# EAGLE design wall_power (EAGLE 6.4)
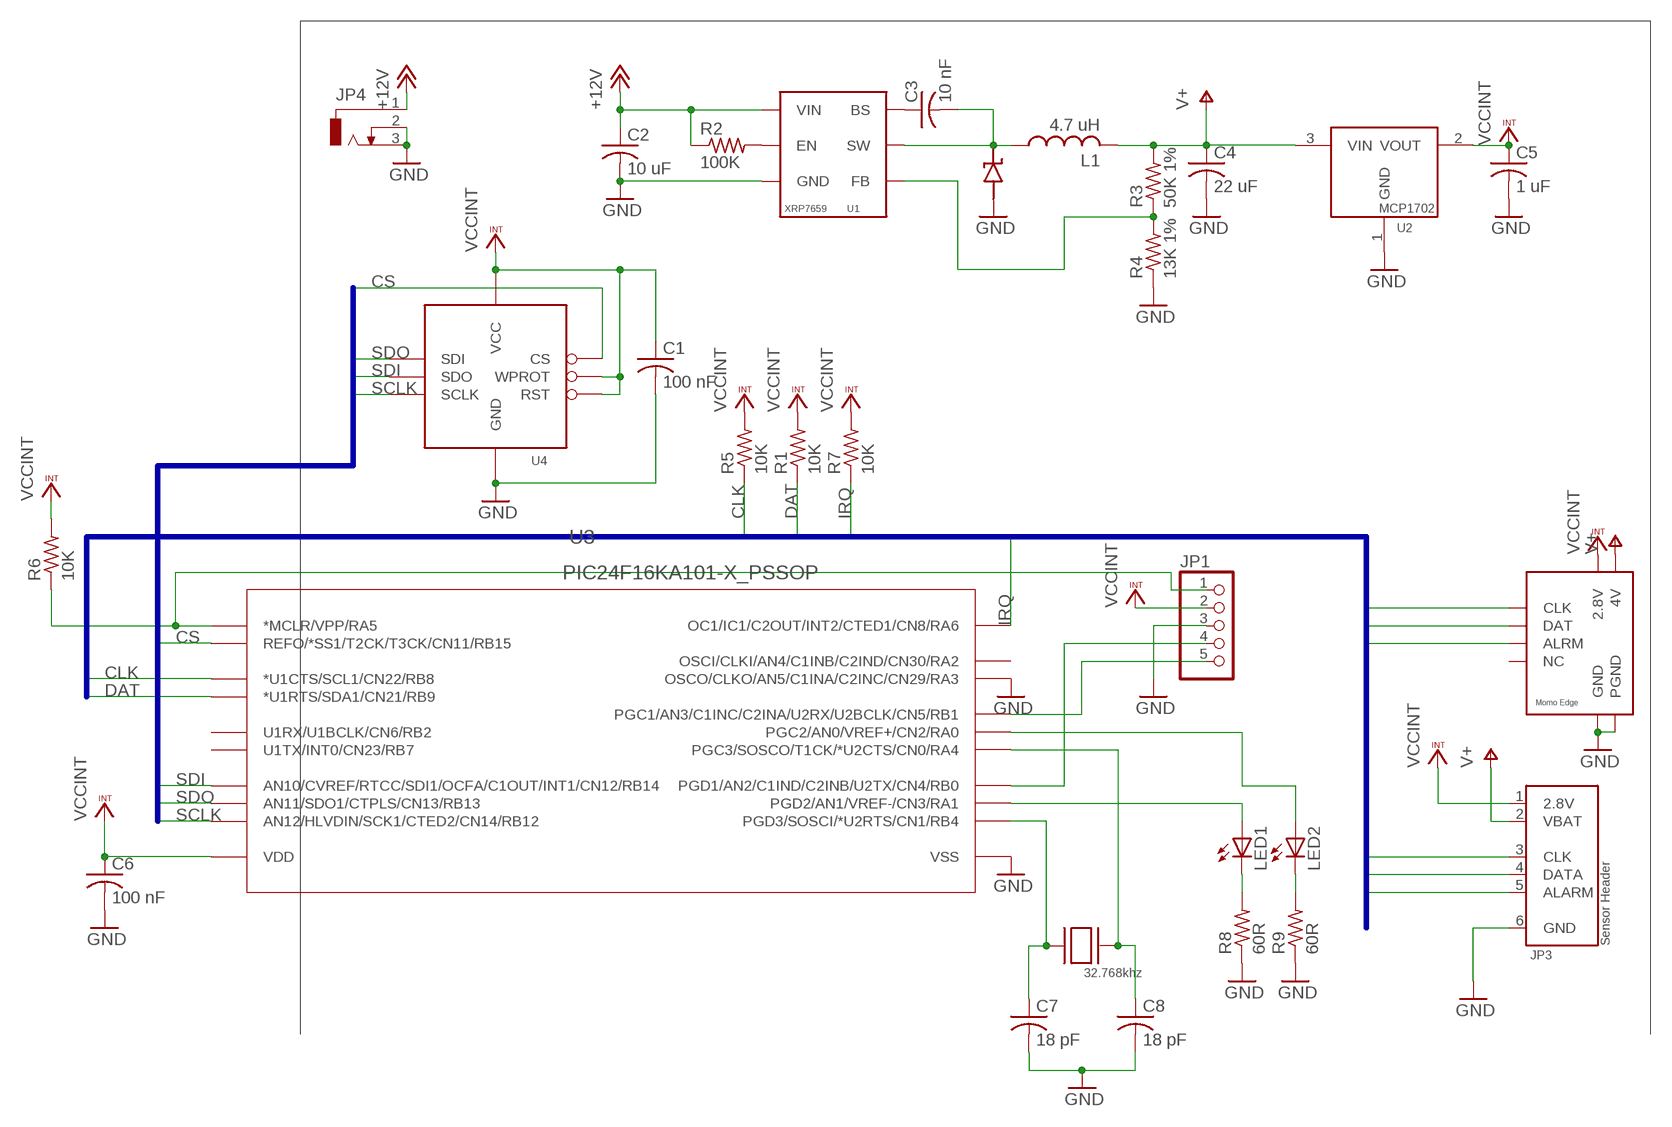
[diagram p0: schematic, sheet 1]

## Parts
C1  100 nF  C-USC0402  [C0402]
C2  10 uF  C-USC0805  [C0805]
C3  10 nF  C-USC0402  [C0402]
C4  22 uF  C-USC1206  [C1206]
C5  1 uF  C-USC0402  [C0402]
C6  100 nF  C-USC0402  [C0402]
C7  18 pF  C-USC0402K  [C0402K]
C8  18 pF  C-USC0402K  [C0402K]
D1  DIODE_SS2P3SS2P3  [DIODE_SS2P3]
JP1  PINHD-1X5  [1X05]
JP2  MOMO-EDGE-8F  [MOMO-EDGE-8F]
JP3  MOMO-SENSOR-HEADER  [2X3-MOLEX-90130]
JP4  DCJ0303  [DCJ0303]
L1  4.7 uH  NR6028-INDUCTOR  [NR6028-INDUCTOR]
LED1  LEDSML0603  [SML0603]
LED2  LEDSML0603  [SML0603]
R1  10K  R-US_R0603  [R0603]
R2  100K  R-US_R0603  [R0603]
R3  50K 1%  R-US_R0603  [R0603]
R4  13K 1%  R-US_R0603  [R0603]
R5  10K  R-US_R0603  [R0603]
R6  10K  R-US_R0603  [R0603]
R7  10K  R-US_R0603  [R0603]
R8  60R  R-US_R0603  [R0603]
R9  60R  R-US_R0603  [R0603]
U1  XRP7659  [SOT23-6L]
U2  MCP1702  [SOT23]
U3  PIC24F16KA101-X_PSSOP  [SSOP20]
U4  FLASH8MSOP8  [SOP08]
XTAL1  32.768khz  SMD-XTAL  [1206]

## Nets
+12V: C2.1 JP4.1 R2.1 U1.5(VIN)
CLK: JP2.CLK JP3.3(CLK) R5.1 U3.12(*U1CTS/SCL1/CN22/RB8)
CS: U3.18(REFO/*SS1/T2CK/T3CK/CN11/RB15) U4.1(CS)
DAT: JP2.DAT JP3.4(DATA) R1.1 U3.13(*U1RTS/SDA1/CN21/RB9)
GND: C1.2 C2.2 C4.2 C5.2 C6.2 C7.2 C8.2 D1.AN JP1.3 JP2.GND JP2.PGND JP3.6(GND) JP4.2 JP4.3 R4.1 R8.1 R9.1 U1.2(GND) U2.1(GND) U3.8(OSCO/CLKO/AN5/C1INA/C2INC/CN29/RA3) U3.19(VSS) U4.4(GND)
IRQ: JP2.ARLM(ALRM) JP3.5(ALARM) R7.1 U3.14(OC1/IC1/C2OUT/INT2/CTED1/CN8/RA6)
N$1: LED2.A U3.2(PGC2/AN0/VREF+/CN2/RA0)
N$2: C3.2 D1.CATH L1.1 U1.6(SW)
N$3: R2.2 U1.4(EN)
N$4: C3.1 U1.1(BS)
N$5: LED2.C R9.2
N$6: R3.1 R4.2 U1.3(FB)
N$7: LED1.C R8.2
N$8: LED1.A U3.3(PGD2/AN1/VREF-/CN3/RA1)
N$9: JP1.4 U3.4(PGD1/AN2/C1IND/C2INB/U2TX/CN4/RB0)
N$10: JP1.5 U3.5(PGC1/AN3/C1INC/C2INA/U2RX/U2BCLK/CN5/RB1)
N$15: JP1.1 R6.1 U3.1(*MCLR/VPP/RA5)
N$24: C8.1 U3.10(PGC3/SOSCO/T1CK/*U2CTS/CN0/RA4) XTAL1.P$2(XTAL2)
N$25: C7.1 U3.9(PGD3/SOSCI/*U2RTS/CN1/RB4) XTAL1.P$1(XTAL1)
SCLK: U3.15(AN12/HLVDIN/SCK1/CTED2/CN14/RB12) U4.6(SCLK)
SDI: U3.17(AN10/CVREF/RTCC/SDI1/OCFA/C1OUT/INT1/CN12/RB14) U4.2(SDO)
SDO: U3.16(AN11/SDO1/CTPLS/CN13/RB13) U4.5(SDI)
V+: C4.1 JP2.V4.(4V) JP3.2(VBAT) L1.2 R3.2 U2.3(VIN)
VCCINT: C1.1 C5.1 C6.1 JP1.2 JP2.V28(2.8V) JP3.1(2.8V) R1.2 R5.2 R6.2 R7.2 U2.2(VOUT) U3.20(VDD) U4.3(WPROT) U4.7(RST) U4.8(VCC)
Unconnected: JP2.NV(NC) U3.6(U1RX/U1BCLK/CN6/RB2) U3.7(OSCI/CLKI/AN4/C1INB/C2IND/CN30/RA2) U3.11(U1TX/INT0/CN23/RB7)

## Buses
PICBUS:CLK,DAT,IRQ
SPI:CS,SDI,SDO,SCLK

## Library data of the parts
C1-C8 = rcl:C-US: CAPACITOR, American symbol
D1 = components:DIODE_SS2P3
JP1 = pinhead:PINHD-1X5: PIN HEADER
JP2 = components:MOMO-EDGE-8F
JP3 = components:MOMO-SENSOR-HEADER
JP4 = con-jack:DCJ0303: DC POWER JACK Source: DCJ0303.pdf; OC_FARNELL: unknown; OC_NEWARK: unknown
L1 = components:NR6028-INDUCTOR
LED1 LED2 = led:LED: LED OSRAM: - CHIPLED LG R971, LG N971, LY N971, LG Q971, LY Q971, LO R971, LY R971 LH N974, LH R974 LS Q976, LO Q976, LY Q976 LO Q996 - Hyper CHIPLED LW Q18S LB Q993, LB Q99A, LB R99A - SideLED LS A670, LO A670, LY A670, LG A670, LP A670 LB A673, LV A673, LT A673, LW A673 LH A674 LY A675 LS A676, LA A676, LO A676, LY A676, LW A676 LS A679, LY A679, LG A679 - Hyper Micro SIDELED® LS Y876, LA Y876, LO Y876, LY Y876 LT Y87S - SmartLED LW L88C, LW L88S LB L89C, LB L89S, LG L890 LS L89K, LO L89K, LY L89K LS L896, LA L896, LO L896, LY L896 - TOPLED LS T670, LO T670, LY T670, LG T670, LP T670 LSG T670, LSP T670, LSY T670, LOP T670, LYG T670 LG T671, LOG T671, LSG T671 LB T673, LV T673, LT T673, LW T673 LH T674 LS T676, LA T676, LO T676, LY T676, LB T676, LH T676, LSB T676, LW T676 LB T67C, LV T67C, LT T67C, LS T67K, LO T67K, LY T67K, LW E67C LS E67B, LA E67B, LO E67B, LY E67B, LB E67C, LV E67C, LT E67C LW T67C LS T679, LY T679, LG T679 LS T770, LO T770, LY T770, LG T770, LP T770 LB T773, LV T773, LT T773, LW T773 LH T774 LS E675, LA E675, LY E675, LS T675 LS T776, LA T776, LO T776, LY T776, LB T776 LHGB T686 LT T68C, LB T68C - Hyper Mini TOPLED® LB M676 - Mini TOPLED Santana® LG M470 LS M47K, LO M47K, LY M47K Source: http://www.osram.convergy.de LUXEON: - LUMILED® LXK2-PW12-R00, LXK2-PW12-S00, LXK2-PW14-U00, LXK2-PW14-V00 LXK2-PM12-R00, LXK2-PM12-S00, LXK2-PM14-U00 LXK2-PE12-Q00, LXK2-PE12-R00, LXK2-PE12-S00, LXK2-PE14-T00, LXK2-PE14-U00 LXK2-PB12-K00, LXK2-PB12-L00, LXK2-PB12-M00, LXK2-PB14-N00, LXK2-PB14-P00, LXK2-PB14-Q00 LXK2-PR12-L00, LXK2-PR12-M00, LXK2-PR14-Q00, LXK2-PR14-R00 LXK2-PD12-Q00, LXK2-PD12-R00, LXK2-PD12-S00 LXK2-PH12-R00, LXK2-PH12-S00 LXK2-PL12-P00, LXK2-PL12-Q00, LXK2-PL12-R00 Source: www.luxeon.com KINGBRIGHT: KA-3528ASYC Source: www.kingbright.com
R1-R9 = rcl:R-US_: RESISTOR, American symbol
U1 = components:XRP7659
U2 = components:MCP1702
U3 = components:PIC24F16KA101-X_P
U4 = components:FLASH8M
XTAL1 = components:SMD-XTAL

## Net classes
0 default: width 0.152 mm, drill 0.305 mm, clearance 0.152 mm

## Board
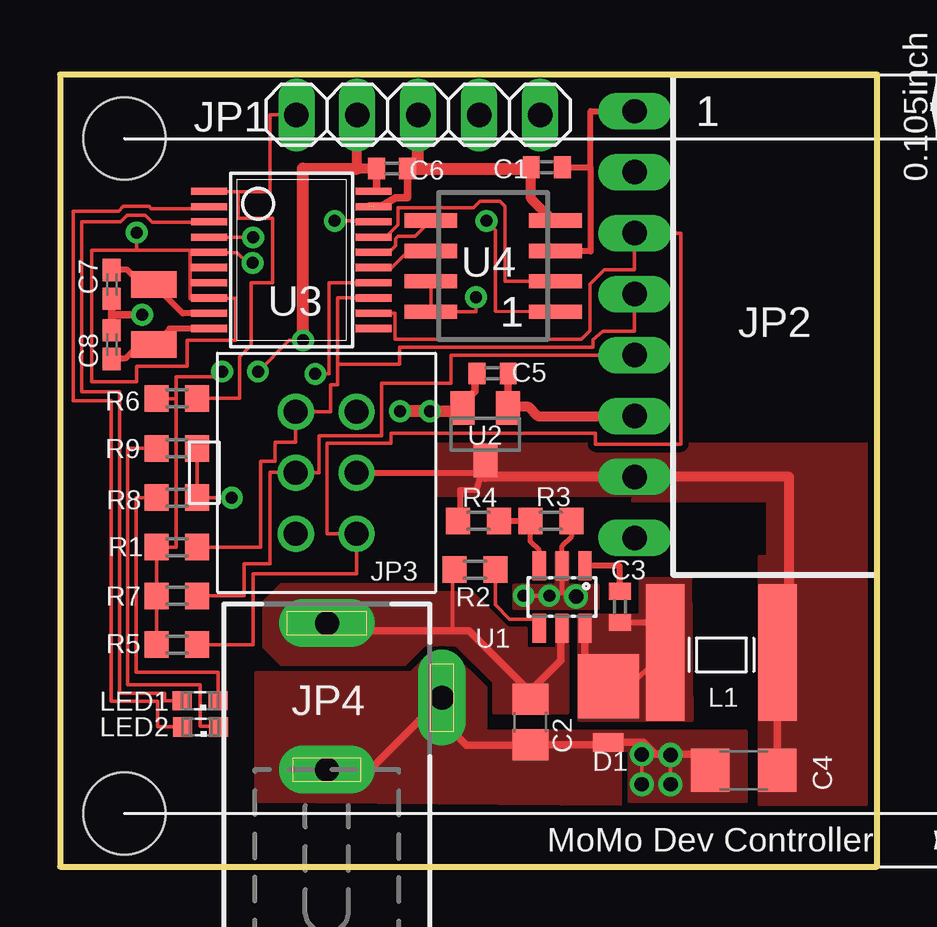
[diagram p1: board, top side]
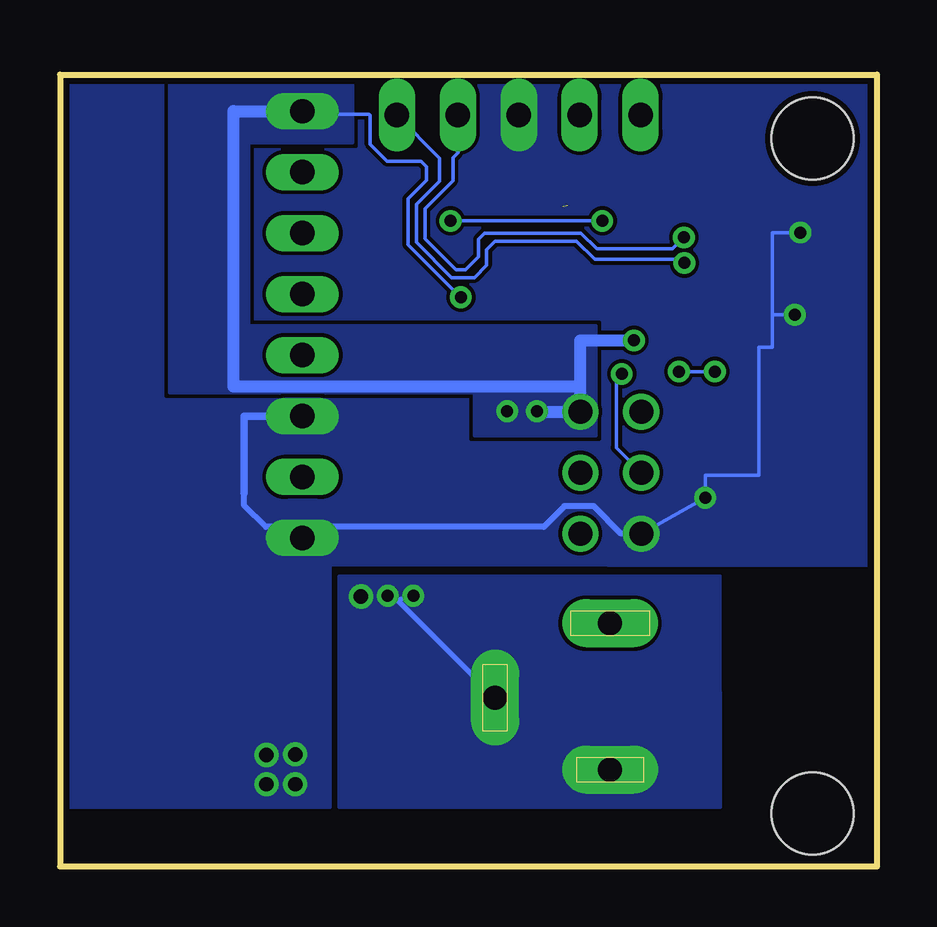
[diagram p2: board, bottom side, seen from below]

Size 34.06 x 32.99 mm. Coordinates in mm from the lower left corner, seen from the top.
Outline: 0,0 34.06,0 34.06,32.99 0,32.99 0,0
Copper layers (1*16): Top 0.035mm / dielectric 1.5mm / Bottom 0.035mm
Design rules "default *": minimum track width 6mil, minimum drill 19mil, track to track 6mil, track to pad 6mil, pad to pad 6mil, via to via 6mil, smd to smd 6mil, copper to edge 10mil, drill to drill 8mil, minimum pad ring 10mil, minimum via ring 8mil, stop-mask expansion 4mil, vias tented up to drill 0mil, thermal gap 10mil
Holes 3.43 mm at 2.69,2.21 2.69,30.33

### Footprints (pad centres in the part's own frame; a part is rotated, then mirrored left to right if it is on the bottom)
C0402 = smd 0.7 x 0.9: 1 -0.65,0; 2 0.65,0
C0805 = smd 1.3 x 1.5: 1 -0.95,0; 2 0.95,0
C1206 = smd 1.6 x 1.8: 1 -1.4,0; 2 1.4,0
C0402K = smd 0.925 x 0.74: 1 -0.6,0; 2 0.6,0
DIODE_SS2P3 = smd 0.762 x 1.27: AN 2.349,0 | smd 2.667 x 2.54: CATH 0,0
1X05 = drill 1.016 long: 1 -5.08,0; 2 -2.54,0; 3 0,0; 4 2.54,0; 5 5.08,0
MOMO-EDGE-8F = drill 1.016 long: ARLM 0,0; CLK 0,5.08; DAT 0,2.54; GND 0,-2.54; NV 0,7.62; PGND 0,-7.62; V4. 0,-5.08; V28 0,10.16
2X3-MOLEX-90130 = drill 1: 1 -2.54,2.54; 2 0,2.54; 3 2.54,2.54; 4 -2.54,0; 5 0,0; 6 2.54,0
DCJ0303 = drill 1 pad 2 long: 1 0,3.1; 2 4.8,0; 3 0,-3
NR6028-INDUCTOR = smd 1.6 x 5.7: 1 0,0; 2 4.7,0
SML0603 = smd 0.8 x 0.8: A 0.75,0; C -0.75,0
R0603 = smd 1 x 1.1: 1 -0.85,0; 2 0.85,0
SOT23-6L = smd 0.55 x 1.2: 1 -0.95,-1.3; 2 0,-1.3; 3 0.95,-1.3; 4 0.95,1.3; 5 0,1.3; 6 -0.95,1.3
SOT23 = smd 1 x 1.4: 1 -0.95,-1.1; 2 0.95,-1.1; 3 0,1.1
SSOP20 = smd 0.3 x 1.5: 1 -2.857,-3.431; 2 -2.222,-3.431; 3 -1.587,-3.431; 4 -0.952,-3.431; 5 -0.317,-3.431; 6 0.318,-3.431; 7 0.953,-3.431; 8 1.588,-3.431; 9 2.223,-3.431; 10 2.858,-3.431; 11 2.858,3.431; 12 2.219,3.431; 13 1.588,3.431; 14 0.953,3.431; 15 0.318,3.431; 16 -0.317,3.431; 17 -0.952,3.431; 18 -1.587,3.431; 19 -2.222,3.431; 20 -2.857,3.431
SOP08 = smd 0.6 x 2.2: 1 -1.905,-2.6; 2 -0.635,-2.6; 3 0.635,-2.6; 4 1.905,-2.6; 5 1.905,2.6; 6 0.635,2.6; 7 -0.635,2.6; 8 -1.905,2.6
1206 = smd 1.1 x 1.9: P$1 0,0; P$2 2.5,0

### Placement (x,y rotation side)
C1  20.29,29.13 180 top
C2  19.61,6.02 270 top
C3  23.34,10.82 270 top
C4  28.5,4.01 180 top
C5  18.03,20.55 0 top
C6  13.84,29.08 0 top
C7  2.16,24.26 270 top
C8  2.16,21.74 90 top
D1  22.86,7.52 270 top
JP1  14.94,31.32 0 top
JP2  23.95,21.31 0 top
JP3  9.83,16.41 270 top
JP4  11.13,7.04 0 top
L1  25.22,8.92 0 top
LED1  5.84,6.91 180 top
LED2  5.87,5.82 180 top
R1  4.88,13.31 180 top
R2  17.3,12.37 0 top
R3  17.45,14.4 180 top
R4  20.47,14.4 180 top
R5  4.88,9.25 180 top
R6  4.88,19.51 180 top
R7  4.88,11.28 180 top
R8  4.88,15.37 180 top
R9  4.88,17.42 180 top
U1  20.93,11.23 180 top
U2  17.73,18.01 180 top
U3  9.65,25.27 270 top
U4  18.06,25.02 90 top
XTAL1  3.91,24.26 270 top

### Tracks (layer width: path | path; a pad name or v marks a point on that pad's centre or on a via)
+12V
  Top 0.152: R2.1 16.36,12.37 16.36,9.83
  Top 0.305: C2.1 19.61,7.26 | 19.61,7.26 17.04,9.83 16.36,9.83 11.43,9.83 JP4.1 | 19.61,7.26 19.61,7.31 20.88,8.58 20.88,9.88 U1.5
  pour Top (no thermals): 21.16,10.44 21.16,6.4 18.08,6.4 18.08,7.67 16.51,9.25 15.19,9.25 14.38,8.43 9.22,8.43 8.51,9.14 8.51,11.02 9.22,11.73 15.62,11.73 15.62,11.4 17.2,11.4 18.67,9.93 19.43,9.93 19.43,9.07 20.73,9.07 20.73,10.44
CLK
  Top 0.152: R5.1 8.05,9.25 8.05,12.19 12.37,12.19 JP3.3 11.13,13.87 11.13,17.63 13.79,17.63 13.79,18.06 22.33,18.06 22.33,17.6 25.88,17.6 25.88,26.39 JP2.CLK 23.95,24.87 22.71,24.87 22.1,24.26 22.1,22.33 21.74,21.97 13.97,21.97 13.97,23.05 U3.12
CS  (via drill 0.5)
  Top 0.152: U4.1 18.16,23.14 18.16,26.52 v17.78,26.9 | v11.46,26.9 12.95,26.9 U3.18
  Bottom 0.152: v17.78,26.9 v11.46,26.9
DAT
  Top 0.152: 12.95,23.67 U3.13 12.95,23.7 11.58,23.7 11.58,20.93 | R1.1 8.36,13.31 8.36,16.89 8.97,16.89 8.97,17.68 9.83,17.68 JP3.4 11.28,18.95 11.28,20.07 11.58,20.07 11.58,20.93 | 11.58,20.93 14.15,20.93 14.15,21.64 22.23,21.64 22.23,21.95 22.63,22.3 23.95,22.3 JP2.DAT
GND  (via drill 0.5, 0.6)  (1 unrouted)
  Top 0.152: v25.45,3.43 v25.45,4.65 25.1,4.44 24.87,4.67 | v24.26,3.43 v24.26,4.67 24.23,4.47 24.63,4.86 | U3.8 7.32,23.68 7.32,21.92 5.31,21.92 5.31,20.85 3.2,20.85 3.2,20.19 1.32,20.19 1.32,25.68 3.2,25.68 | 3.2,25.68 5.44,25.68 5.44,23.65 6.4,23.65 6.4,23.67 | R9.1 R8.1 v7.16,15.37 | v3.2,26.42 3.2,25.68
  Top 0.203: R4.1 21.34,14.39 21.34,13.77 20.93,13.36 U1.2 20.93,11.4 v20.4,11.28 20.02,11.25 v19.33,11.28
  Top 0.305: JP4.3 12.93,4.04 JP4.2 15.93,6.07 16.94,5.05 19.59,5.05 C2.2 22.76,5.07 D1.AN 24.32,5.17 24.63,4.86 24.82,4.67 24.87,4.67 27,4.67 C4.2 | U2.1 C5.2 | C6.2 14.49,27.86 14,27.86 13.44,27.53 12.92,27.53 | C7.2 2.16,22.99 | 2.16,22.99 C8.2 2.18,22.34 2.18,22.99 | 2.18,22.99 2.16,22.99 | 2.18,22.99 v3.43,22.99
  Top 0.406: U2.1 18.72,19.15 19.53,19.15 19.91,18.77 JP2.GND | 19.76,29.13 C1.2 19.64,27.83 20.55,26.92 U4.4
  Top 0.508: C1.2 19.64,29.08 C6.2 14.94,29.08 JP1.3
  Bottom 0.152: JP3.6 v7.16,15.37 7.16,16.31 4.93,16.31 4.93,21.64 4.37,21.64 4.37,22.99 | v3.43,22.99 4.37,22.99 | 4.37,22.99 4.37,26.42 v3.2,26.42
  Bottom 0.203: v19.33,11.28 19.99,11.1 JP4.2
  Bottom 0.254: JP3.6 10.67,13.87 11.81,15.01 13.03,15.01 13.89,14.15 25.48,14.15 26.39,15.06 26.39,15.54 26.39,16.33
  Bottom 0.305: JP2.GND 26.39,18.77 26.39,15.54
  other vias: 21.51,11.25
  pour Top (no thermals): 23.37,5.64 23.37,2.59 8.18,2.72 8.18,8.08 14.63,8.08 15.44,8.89 16.31,8.89 17.73,7.47 17.73,5.64
  pour Top (no thermals): 20.7,13.08 20.7,11.71 18.92,11.71 18.92,10.77 22.43,10.77 22.43,11.71 21.16,11.71 21.16,13.08
  pour Bottom (no thermals): 22.43,12.09 6.55,12.12 6.53,2.46 22.43,2.46
  pour Top (no thermals): 23.39,5.64 28.6,5.64 28.6,2.69 23.75,2.72 23.75,4.85 23.39,4.85
  pour Bottom (rank 2, no thermals): -0.3,12.52 22.81,12.57 22.81,2.46 34.09,2.46 34.09,33.05 -0.33,33.05
IRQ  (via drill 0.5)
  Top 0.152: JP2.ARLM 16.31,21.31 16.31,20.14 13.41,20.14 13.41,17.96 10.8,17.96 10.8,16.41 JP3.5 | 9.83,16.33 JP3.5 | R7.1 7.67,11.28 7.67,12.62 8.76,12.62 8.76,16.43 9.83,16.43 JP3.5 | U3.14 11.23,24.32 11.23,20.52 v10.64,20.52
  Bottom 0.152: v10.64,20.52 10.87,20.52 10.87,17.45 JP3.5
N$1
  Top 0.152: U3.2 6.35,27.43 5.92,27.43 5.89,27.41 3.81,27.41 3.71,27.51 2.64,27.51 2.44,27.3 0.56,27.3 0.56,19.41 2.13,19.41 2.13,6.88 4.06,6.88 4.06,5.82 LED2.A
N$2
  Top 0.152: 24.78,11.47 24.79,11.46 24.79,9.42 L1.1
  Top 0.203: D1.CATH 23.7,7.52 L1.1
  Top 0.254: C3.2 25.32,10.17 25.32,10.26 25.22,10.26 L1.1
  Top 0.305: U1.6 21.88,8.5 D1.CATH
  pour Top (no thermals): 21.64,10.46 24.21,10.46 24.21,11.99 26.29,11.99 26.34,6.1 21.64,6.1
N$3
  Top 0.152: R2.2 18.15,10.91 18.75,10.31 19.98,10.31 U1.4
N$4
  Top 0.254: C3.1 23.34,12.52 U1.1
N$5
  Top 0.152: R9.2 2.82,17.42 2.82,7.57 5.84,7.57 5.84,5.84 6.62,5.84 LED2.C
N$6
  Top 0.203: U1.3 19.98,13.17 19.61,13.54 19.61,14.39 R4.2
  Top 0.254: R3.1 R4.2
N$7
  Top 0.152: R8.2 3.18,15.37 3.18,8.1 6.59,8.1 LED1.C
N$8
  Top 0.152: U3.3 6.34,26.85 3.84,26.85 3.56,27.13 2.79,27.13 2.53,26.86 0.91,26.86 0.91,19.79 2.49,19.79 2.49,7.21 4.37,7.21 4.37,6.91 LED1.A
N$9  (via drill 0.5)
  Top 0.152: v8.05,26.21 6.36,26.21 U3.4
  Bottom 0.152: JP1.4 17.48,29.74 17.68,29.54 17.68,28.57 18.85,27.41 18.85,26.16 17.55,24.87 17.15,24.87 16.61,25.4 16.61,26.14 16.36,26.39 12.34,26.39 11.68,25.73 8.53,25.73 v8.05,26.21
N$10  (via drill 0.5)
  Top 0.152: v8.03,25.15 7.82,25.15 7.39,25.58 6.36,25.58 U3.5
  Bottom 0.152: JP1.5 20.02,31.29 18.24,29.51 18.24,28.55 19.2,27.58 19.2,26.01 17.73,24.54 16.79,24.54 16.28,25.04 16.28,25.7 15.93,26.06 12.52,26.06 11.76,25.3 8.18,25.3 v8.03,25.15
N$15
  Top 0.152: R6.1 7.49,19.51 7.49,21.23 7.98,21.72 7.98,24.33 8.86,24.33 8.86,27 7.42,27 7.42,28.12 | 7.42,28.12 6.35,28.12 U3.1 | 7.42,28.12 8.76,28.12 8.76,31.32 JP1.1
N$24
  Top 0.254: U3.10 4.57,22.41 XTAL1.P$2 3.32,21.76 2.72,21.16 2.17,21.16 C8.1
N$25
  Top 0.254: U3.9 5.12,23.05 XTAL1.P$1 3.4,24.26 2.79,24.87 C7.1
SCLK
  Top 0.152: U4.6 14.53,25.65 13.82,24.94 12.97,24.94 U3.15
SDI
  Top 0.152: U3.17 12.97,26.24 13.59,26.24 14.1,26.75 14.1,27.46 17.25,27.46 17.5,27.71 18.34,27.71 18.54,27.51 18.54,24.38 U4.2
SDO
  Top 0.152: U3.16 13.73,25.59 14,25.86 14,26.16 14.1,26.26 14.8,26.26 U4.5
V+
  Top 0.254: R3.2 16.69,14.4 16.69,15.7 17.37,15.7 17.59,16.42 | 17.59,16.42 U2.3 | 29.9,9.02 30.07,9.02 | JP3.2 17.57,16.41 17.59,16.42
  Top 0.305: C4.1 29.9,9.02 L1.2 29.95,9.02
  Top 0.406: 30.07,9.02 30.4,9.02 30.4,16.23 JP2.V4. 17.73,16.23 U2.3
  pour Top (isolate 0.254, no thermals): 29.16,12.9 29.16,2.59 34.09,2.59 34.11,17.6 15.7,17.6 15.7,15.47 23.9,15.44 23.88,15.24 29.51,15.24 29.51,12.9
VCCINT  (via drill 0.5)
  Top 0.152: U4.7 U4.8 17.35,23.11 v17.35,23.72 | R5.2 R7.2 R1.2 4.85,13.31 4.85,19.48 | 4.85,19.48 4.03,19.48 R6.2 | 4.85,19.48 4.85,20.4 6.76,20.4 v6.76,20.62 | v8.26,20.62 9.55,21.92 v10.13,21.92
  Top 0.254: 16.62,18.95 U2.2 | C1.1 22.12,29.13 | 22.12,29.13 22.12,25.63 20.66,25.63 U4.3 | 22.12,29.13 22.12,31.47 JP2.V28
  Top 0.305: U2.2 16.78,19.29 17.3,19.81 17.3,20.46 C5.1 | C6.1 13.19,28.13 U3.20
  Top 0.406: C6.1 12.4,29.08 JP1.2
  Top 0.508: 16.62,18.95 v15.42,18.97 v14.17,18.97 | v10.13,21.92 10.13,29.08 12.4,29.08
  Bottom 0.152: v17.35,23.72 17.37,23.72 19.56,25.91 19.56,27.81 18.77,28.6 18.77,29.16 19,29.39 20.42,29.39 21.13,30.1 21.13,31.29 21.18,31.34 23.29,31.34 23.42,31.47 JP2.V28 | v6.76,20.62 v8.26,20.62
  Bottom 0.508: v14.17,18.97 14.17,18.95 JP3.1 12.37,19.99 | v10.13,21.92 12.37,21.92 12.37,19.99 | 12.37,19.99 26.82,19.99 26.82,31.47 JP2.V28
  pour Bottom (no thermals): 11.71,17.96 16.79,17.96 16.79,19.48 16.79,19.74 29.49,19.74 29.49,32.69 21.87,32.69 21.87,30.4 21.87,30.15 26.19,30.15 26.19,22.53 11.71,22.53

### Text on the board
tPlace: L1 | MoMo Dev Controller